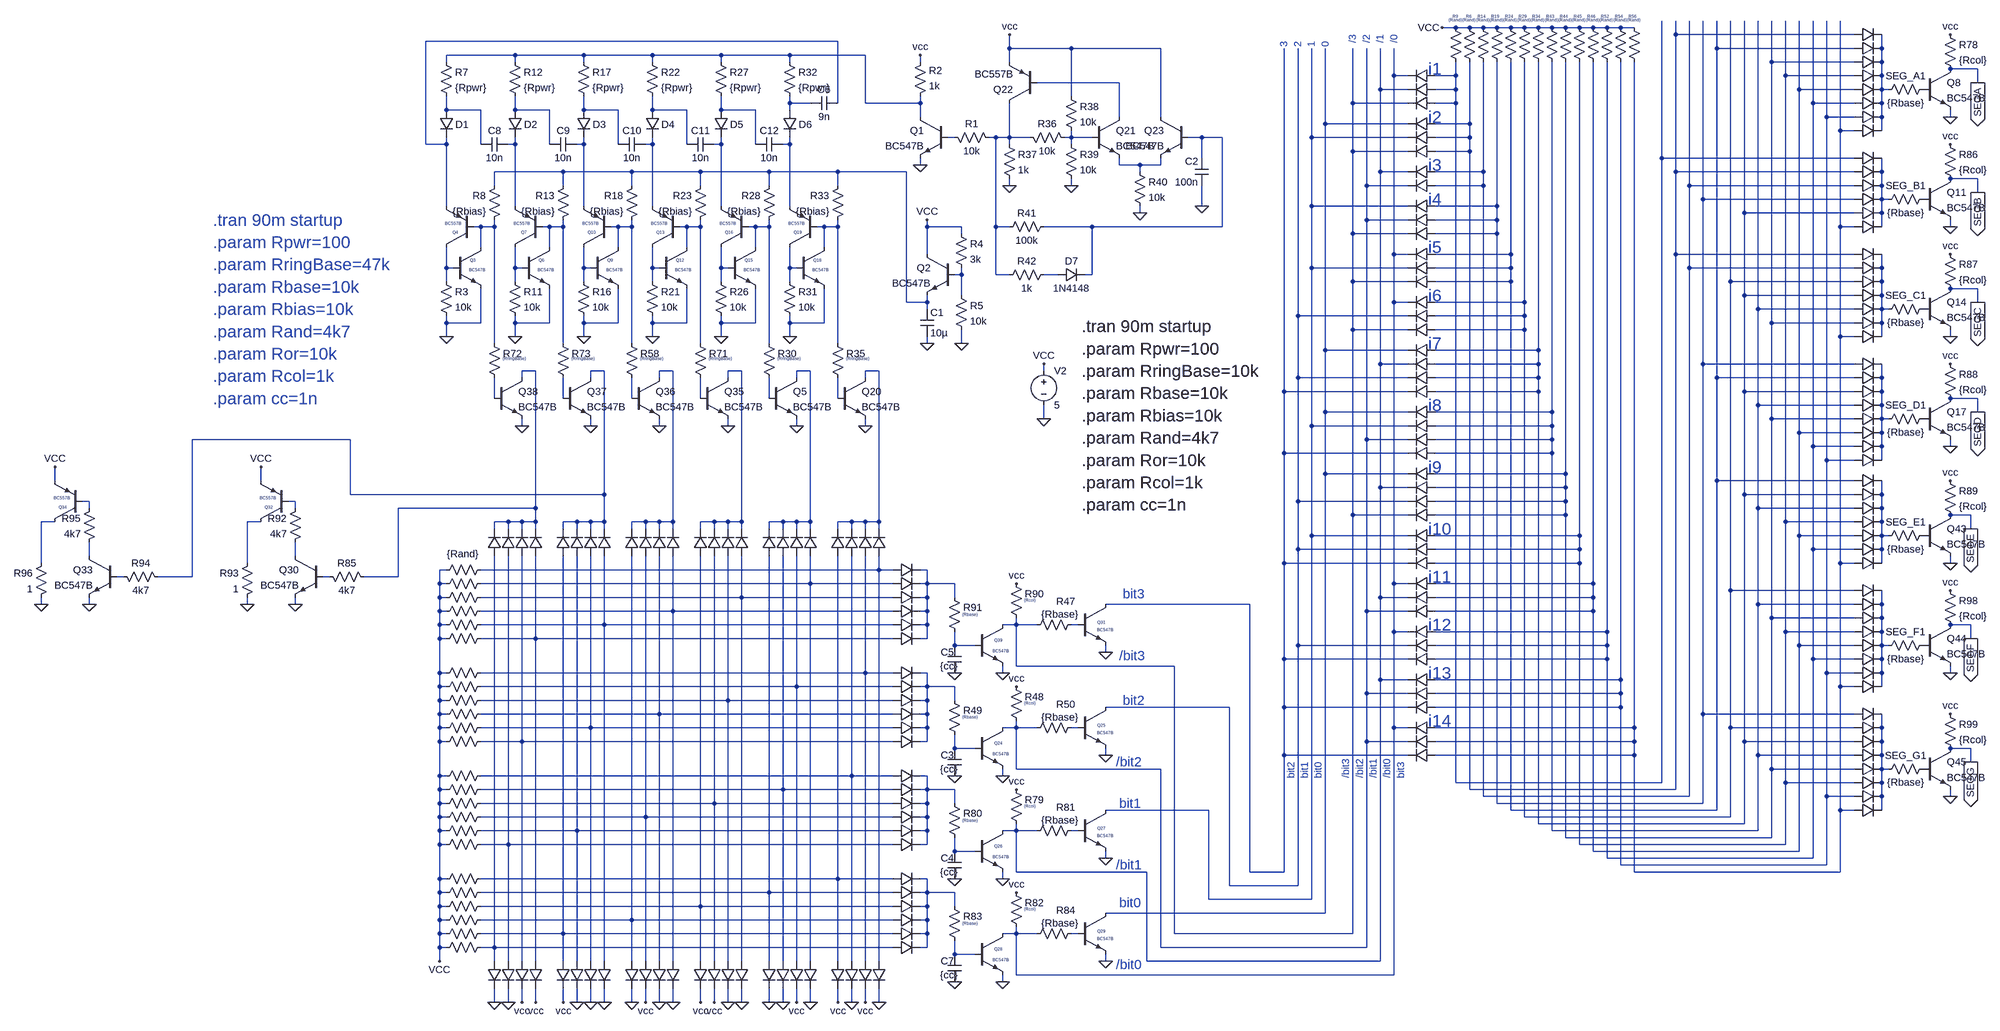
[diagram p0: schematic 24bitTo7SegDecoder.asc]
* 24bitTo7SegDecoder.asc
R1 N024 N025 10k
Q1 N005 N024 0 0 BC547B
V2 VCC 0 5
R2 N005 VCC 1k
R4 VCC N054 3k
R5 N054 0 10k
C1 N035 0 10µ
Q2 VCC N054 N035 0 BC547B
Q3 N041 N047 0 0 BC547B
R3 N047 0 10k
R7 N005 N016 {Rpwr}
R8 N035 N041 {Rbias}
Q4 N047 N041 N002 0 BC557B
C8 N029 N016 10n
Q6 N042 N048 0 0 BC547B
R11 N048 0 10k
R12 N005 N017 {Rpwr}
R13 N035 N042 {Rbias}
Q7 N048 N042 N029 0 BC557B
C9 N030 N017 10n
Q9 N043 N049 0 0 BC547B
R16 N049 0 10k
R17 N005 N018 {Rpwr}
R18 N035 N043 {Rbias}
Q10 N049 N043 N030 0 BC557B
C10 N031 N018 10n
Q12 N044 N050 0 0 BC547B
R21 N050 0 10k
R22 N005 N019 {Rpwr}
R23 N035 N044 {Rbias}
Q13 N050 N044 N031 0 BC557B
C11 N032 N019 10n
Q15 N045 N051 0 0 BC547B
R26 N051 0 10k
R27 N005 N020 {Rpwr}
R28 N035 N045 {Rbias}
Q16 N051 N045 N032 0 BC557B
C12 N033 N020 10n
Q18 N046 N052 0 0 BC547B
R31 N052 0 10k
R32 N005 N013 {Rpwr}
R33 N035 N046 {Rbias}
D6 N013 N033 1N4148
Q19 N052 N046 N033 0 BC557B
Q20 N064 N072 0 0 BC547B
Q21 N010 N026 N034 0 BC547B
R36 N025 N026 10k
Q22 N025 N010 VCC 0 BC557B
Q23 VCC N027 N034 0 BC547B
R37 N025 0 1k
R38 VCC N026 10k
R39 N026 0 10k
R40 N034 0 10k
C2 N027 0 100n
R41 N025 N027 100k
D7 N055 N027 1N4148
R42 N025 N055 1k
D40 N118 0 1N4148
R9 N008 VCC {Rand}
D80 N008 N007 1N914
D133 N008 N011 1N914
D134 N008 N014 1N914
D135 N001 N022 1N914
D136 N001 N028 1N914
D137 N001 N014 1N914
D138 N036 N011 1N914
D139 N036 N038 1N914
D140 N039 N028 1N914
D141 N039 N038 1N914
D142 N039 N014 1N914
D143 N003 N007 1N914
D144 N003 N028 1N914
D145 N003 N014 1N914
D146 N056 N007 1N914
D147 N056 N058 1N914
D148 N056 N014 1N914
D149 N040 N022 1N914
D150 N040 N011 1N914
D151 N040 N058 1N914
D152 N040 N066 1N914
D153 N057 N022 1N914
D154 N057 N028 1N914
D155 N057 N038 1N914
D156 N057 N066 1N914
D157 N006 N022 1N914
D158 N006 N011 1N914
D159 N006 N058 1N914
D160 N006 N014 1N914
D161 N009 N028 1N914
D162 N009 N058 1N914
D163 N009 N066 1N914
D164 N012 N007 1N914
D165 N012 N011 1N914
D166 N012 N038 1N914
D167 N015 N007 1N914
D168 N015 N058 1N914
D169 N015 N066 1N914
D170 N021 N011 1N914
D171 N021 N038 1N914
D172 N021 N066 1N914
D173 N023 N007 1N914
D174 N023 N038 1N914
D175 N023 N066 1N914
Q5 N063 N071 0 0 BC547B
Q39 N014 N091 0 0 BC547B
R90 VCC N014 {Rcol}
R91 N081 N091 {Rbase}
Q31 N066 N089 0 0 BC547B
R47 N089 N014 {Rbase}
R30 N045 N071 {RringBase}
R35 N046 N072 {RringBase}
R6 N001 VCC {Rand}
R14 N036 VCC {Rand}
R19 N039 VCC {Rand}
R24 N003 VCC {Rand}
R29 N056 VCC {Rand}
R34 N040 VCC {Rand}
R43 N057 VCC {Rand}
R44 N006 VCC {Rand}
R45 N009 VCC {Rand}
R46 N012 VCC {Rand}
R52 N015 VCC {Rand}
R54 N021 VCC {Rand}
R56 N023 VCC {Rand}
Q35 N062 N070 0 0 BC547B
Q36 N061 N069 0 0 BC547B
R58 N043 N069 {RringBase}
R71 N044 N070 {RringBase}
Q37 N060 N068 0 0 BC547B
Q38 N059 N067 0 0 BC547B
R72 N041 N067 {RringBase}
R73 N042 N068 {RringBase}
R77 VCC N080 {Rand}
D20 N118 N059 1N4148
Q8 SEGA P001 0 0 BC547B
R78 VCC SEGA {Rcol}
Q11 SEGB P002 0 0 BC547B
Q14 SEGC P003 0 0 BC547B
Q17 SEGD P004 0 0 BC547B
Q43 SEGE P005 0 0 BC547B
Q44 SEGF P006 0 0 BC547B
Q45 SEGG P007 0 0 BC547B
D176 N001 N004 1N914
D177 N003 N004 1N914
D178 N006 N004 1N914
D179 N009 N004 1N914
D180 N012 N004 1N914
D181 N015 N004 1N914
D182 N021 N004 1N914
D183 N023 N004 1N914
D184 N008 N037 1N914
D185 N001 N037 1N914
D186 N036 N037 1N914
D187 N039 N037 1N914
D188 N040 N037 1N914
D189 N023 N037 1N914
D190 N001 N053 1N914
D191 N036 N053 1N914
D192 N056 N053 1N914
D193 N040 N053 1N914
D194 N057 N053 1N914
D195 N006 N053 1N914
D196 N023 N053 1N914
D197 N039 N065 1N914
D198 N003 N065 1N914
D199 N040 N065 1N914
D200 N057 N065 1N914
D201 N006 N065 1N914
D202 N012 N065 1N914
D203 N015 N065 1N914
D204 N021 N065 1N914
D205 N003 N073 1N914
D206 N040 N073 1N914
D207 N057 N073 1N914
D208 N009 N073 1N914
D209 N012 N073 1N914
D210 N015 N073 1N914
D211 N023 N073 1N914
D212 N056 N086 1N914
D213 N057 N086 1N914
D214 N006 N086 1N914
D215 N009 N086 1N914
D216 N012 N086 1N914
D217 N015 N086 1N914
D218 N021 N086 1N914
D219 N023 N086 1N914
D220 N039 N099 1N914
D221 N056 N099 1N914
D222 N040 N099 1N914
D223 N057 N099 1N914
D224 N006 N099 1N914
D225 N009 N099 1N914
D226 N021 N099 1N914
D227 N023 N099 1N914
R§SEG_A1 N004 P001 {Rbase}
R§SEG_B1 N037 P002 {Rbase}
R§SEG_C1 N053 P003 {Rbase}
R§SEG_D1 N065 P004 {Rbase}
R§SEG_E1 N073 P005 {Rbase}
R§SEG_F1 N086 P006 {Rbase}
R§SEG_G1 N099 P007 {Rbase}
R86 VCC SEGB {Rcol}
R87 VCC SEGC {Rcol}
R88 VCC SEGD {Rcol}
R89 VCC SEGE {Rcol}
R98 VCC SEGF {Rcol}
R99 VCC SEGG {Rcol}
C5 N091 0 {cc}
C6 N002 N013 9n
D4 N019 N031 1N4148
D5 N020 N032 1N4148
D1 N016 N002 1N4148
D2 N017 N029 1N4148
D3 N018 N030 1N4148
Q24 N038 N101 0 0 BC547B
R48 VCC N038 {Rcol}
R49 N093 N101 {Rbase}
Q25 N058 N098 0 0 BC547B
C3 N101 0 {cc}
Q26 N011 N110 0 0 BC547B
R79 VCC N011 {Rcol}
R80 N103 N110 {Rbase}
Q27 N028 N108 0 0 BC547B
C4 N110 0 {cc}
Q28 N007 N119 0 0 BC547B
R82 VCC N007 {Rcol}
R83 N112 N119 {Rbase}
Q29 N022 N117 0 0 BC547B
C7 N119 0 {cc}
R50 N098 N038 {Rbase}
R81 N108 N011 {Rbase}
R84 N117 N007 {Rbase}
D32 N109 0 1N4148
D33 N100 VCC 1N4148
D34 N090 VCC 1N4148
D35 N116 VCC 1N4148
D36 N107 0 1N4148
D37 N097 0 1N4148
D38 N088 0 1N4148
D39 N115 0 1N4148
D41 N106 VCC 1N4148
D42 N096 0 1N4148
D43 N087 0 1N4148
D44 N114 VCC 1N4148
D45 N105 VCC 1N4148
D46 N095 0 1N4148
D47 N085 0 1N4148
D48 N113 0 1N4148
D49 N104 0 1N4148
D50 N094 VCC 1N4148
D51 N084 0 1N4148
D52 N111 VCC 1N4148
D53 N102 0 1N4148
D54 N092 VCC 1N4148
D55 N080 0 1N4148
D8 N118 N112 1N4148
D9 N116 N112 1N4148
D10 N115 N112 1N4148
D11 N114 N112 1N4148
D12 N113 N112 1N4148
D13 N111 N112 1N4148
D14 N109 N103 1N4148
D15 N107 N103 1N4148
D16 N106 N103 1N4148
D17 N105 N103 1N4148
D18 N104 N103 1N4148
D19 N102 N103 1N4148
D28 N100 N093 1N4148
D29 N097 N093 1N4148
D30 N096 N093 1N4148
D31 N095 N093 1N4148
D72 N094 N093 1N4148
D73 N092 N093 1N4148
D74 N090 N081 1N4148
D75 N088 N081 1N4148
D76 N087 N081 1N4148
D77 N085 N081 1N4148
D78 N084 N081 1N4148
D79 N080 N081 1N4148
D21 N109 N059 1N4148
D22 N100 N059 1N4148
D23 N090 N059 1N4148
D24 N116 N060 1N4148
D25 N107 N060 1N4148
D26 N097 N060 1N4148
D27 N088 N060 1N4148
D56 N115 N061 1N4148
D57 N106 N061 1N4148
D58 N096 N061 1N4148
D59 N087 N061 1N4148
D60 N114 N062 1N4148
D61 N105 N062 1N4148
D62 N095 N062 1N4148
D63 N085 N062 1N4148
D64 N113 N063 1N4148
D65 N104 N063 1N4148
D66 N094 N063 1N4148
D67 N084 N063 1N4148
D68 N111 N064 1N4148
D69 N102 N064 1N4148
D70 N092 N064 1N4148
D71 N080 N064 1N4148
R10 VCC N084 {Rand}
R15 VCC N085 {Rand}
R20 VCC N087 {Rand}
R25 VCC N088 {Rand}
R51 VCC N090 {Rand}
R53 VCC N092 {Rand}
R55 VCC N094 {Rand}
R57 VCC N095 {Rand}
R59 VCC N096 {Rand}
R60 VCC N097 {Rand}
R61 VCC N100 {Rand}
R62 VCC N102 {Rand}
R63 VCC N104 {Rand}
R64 VCC N105 {Rand}
R65 VCC N106 {Rand}
R66 VCC N107 {Rand}
R67 VCC N109 {Rand}
R68 VCC N111 {Rand}
R69 VCC N113 {Rand}
R70 VCC N114 {Rand}
R74 VCC N115 {Rand}
R75 VCC N116 {Rand}
R76 VCC N118 {Rand}
Q30 N079 N083 0 0 BC547B
R85 N059 N083 4k7
Q32 N077 N075 VCC 0 BC557B
R92 N075 N079 4k7
R93 N077 0 1
Q33 N078 N082 0 0 BC547B
R94 N060 N082 4k7
Q34 N076 N074 VCC 0 BC557B
R95 N074 N078 4k7
R96 N076 0 1
.model D D
.lib standard.dio
.model NPN NPN
.model PNP PNP
.lib standard.bjt
.tran 90m startup
.param Rpwr=100
.param RringBase=10k
.param Rbase=10k
.param Rbias=10k
.param Rand=4k7
.param Ror=10k
.param Rcol=1k
.param cc=1n
* /0
* /1
* /2
* /3
* 0
* 1
* 2
* 3
* i1
* i2
* i3
* i4
* i5
* i6
* i7
* i8
* i9
* i10
* i11
* i12
* i13
* i14
* /bit0
* /bit1
* /bit2
* /bit3
* bit0
* bit1
* bit2
* bit3
* /bit3
* bit3
* /bit2
* bit2
* bit1
* /bit1
* bit0
* /bit0
* .tran 90m startup
* .param Rpwr=100
* .param RringBase=47k
* .param Rbase=10k
* .param Rbias=10k
* .param Rand=4k7
* .param Ror=10k
* .param Rcol=1k
* .param cc=1n
.backanno
.end